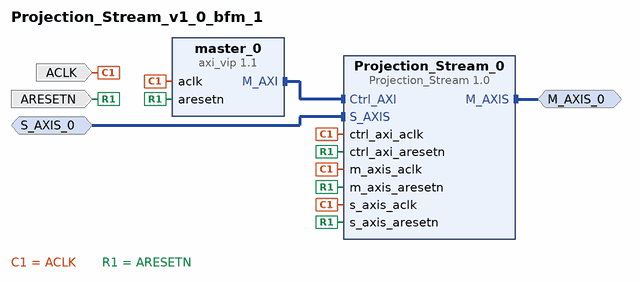
[diagram p0: block diagram of the top level]
# Vivado block design Projection_Stream_v1_0_bfm_1, xc7a100tcsg324-1, Vivado 2018.2
create_bd_design Projection_Stream_v1_0_bfm_1

create_bd_intf_port -mode Slave -vlnv xilinx.com:interface:axis_rtl:1.0 S_AXIS_0
set_property -dict [list \
  CONFIG.TDATA_NUM_BYTES 4 \
  CONFIG.TDEST_WIDTH 0 \
  CONFIG.TID_WIDTH 0 \
  CONFIG.TUSER_WIDTH 0 \
  CONFIG.HAS_TREADY 1 \
  CONFIG.HAS_TSTRB 1 \
  CONFIG.HAS_TKEEP 0 \
  CONFIG.HAS_TLAST 1 \
  CONFIG.CLK_DOMAIN Projection_Stream_v1_0_bfm_1_ACLK \
  CONFIG.LAYERED_METADATA undef \
] [get_bd_intf_ports S_AXIS_0]
create_bd_intf_port -mode Master -vlnv xilinx.com:interface:axis_rtl:1.0 M_AXIS_0
set_property -dict {CONFIG.CLK_DOMAIN Projection_Stream_v1_0_bfm_1_ACLK} [get_bd_intf_ports M_AXIS_0]
create_bd_port -dir I -type clk ACLK
set_property -dict [list \
  CONFIG.FREQ_HZ 100000000 \
  CONFIG.PHASE 0.000 \
  CONFIG.CLK_DOMAIN Projection_Stream_v1_0_bfm_1_ACLK \
  CONFIG.ASSOCIATED_RESET ARESETN \
] [get_bd_ports ACLK]
create_bd_port -dir I -type rst ARESETN
set_property -dict {CONFIG.POLARITY ACTIVE_LOW} [get_bd_ports ARESETN]

create_bd_cell -type ip -vlnv xilinx.com:user:Projection_Stream:1.0 Projection_Stream_0
create_bd_cell -type ip -vlnv xilinx.com:ip:axi_vip:1.1 master_0
set_property -dict [list \
  CONFIG.PROTOCOL AXI4LITE \
  CONFIG.READ_WRITE_MODE READ_WRITE \
  CONFIG.INTERFACE_MODE MASTER \
  CONFIG.ADDR_WIDTH 32 \
  CONFIG.DATA_WIDTH 32 \
  CONFIG.HAS_PROT 1 \
  CONFIG.HAS_WSTRB 1 \
  CONFIG.HAS_BRESP 1 \
  CONFIG.HAS_RRESP 1 \
] [get_bd_cells master_0]

# ---- connections ----

connect_bd_intf_net [get_bd_intf_pins master_0/M_AXI] [get_bd_intf_pins Projection_Stream_0/Ctrl_AXI]
connect_bd_intf_net -intf_net S_AXIS_0_1 [get_bd_intf_ports S_AXIS_0] [get_bd_intf_pins Projection_Stream_0/S_AXIS]
connect_bd_intf_net [get_bd_intf_ports M_AXIS_0] [get_bd_intf_pins Projection_Stream_0/M_AXIS]
connect_bd_net -net aclk_net [get_bd_ports ACLK] \
  [get_bd_pins master_0/aclk] [get_bd_pins Projection_Stream_0/ctrl_axi_aclk] [get_bd_pins Projection_Stream_0/s_axis_aclk] \
  [get_bd_pins Projection_Stream_0/m_axis_aclk]
connect_bd_net -net aresetn_net [get_bd_ports ARESETN] \
  [get_bd_pins master_0/aresetn] [get_bd_pins Projection_Stream_0/ctrl_axi_aresetn] \
  [get_bd_pins Projection_Stream_0/s_axis_aresetn] [get_bd_pins Projection_Stream_0/m_axis_aresetn]

# ---- address map ----
assign_bd_address -offset 0x44A00000 -range 64K -target_address_space [get_bd_addr_spaces master_0/Master_AXI] [get_bd_addr_segs Projection_Stream_0/Ctrl_AXI/Ctrl_AXI_reg]

validate_bd_design
save_bd_design
